# Altium schematic sheet SCH_NUCLEO.SchDoc
size A4
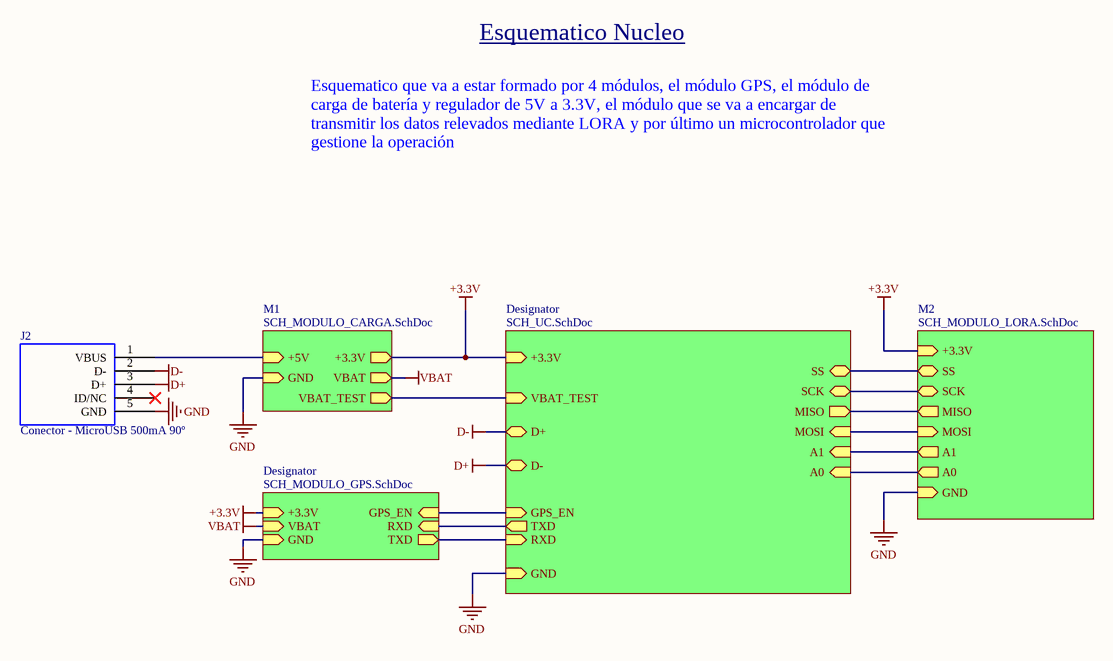
[diagram p0: SCH_NUCLEO.SchDoc]

## Parts
J2  Conector - MicroUSB 500mA 90º

## Sub-sheets
Designator = SCH_MODULO_GPS.SchDoc: +3.3V (in), VBAT (in), GND (in), GPS_EN (in), RXD (in), TXD (out)
Designator = SCH_UC.SchDoc: VBAT_TEST (in), D+ (bidir), MISO (out), A0 (in), GND (in), MOSI (in), +3.3V (in), GPS_EN (in), SCK (bidir), A1 (in), SS (bidir), D- (bidir), TXD (out), RXD (in)
M1 = SCH_MODULO_CARGA.SchDoc: +5V (in), GND (in), +3.3V (out), VBAT (out), VBAT_TEST (out)
M2 = SCH_MODULO_LORA.SchDoc: SCK (bidir), SS (bidir), GND (in), +3.3V (in), MISO (out), MOSI (in), A1 (out), A0 (out)

## Nets
+3.3V: sheet M1/+3.3V, sheet M2/+3.3V, sheet Designator/+3.3V, sheet Designator/+3.3V
D+: J2.3(D+) ; sheet Designator/D-
D-: J2.2(D-) ; sheet Designator/D+
GND: J2.5(GND) ; sheet M1/GND, sheet M2/GND, sheet Designator/GND, sheet Designator/GND
VBAT: sheet M1/VBAT, sheet Designator/VBAT
NetJ2_1: J2.1(VBUS) ; sheet M1/+5V
(unnamed): sheet M1/VBAT_TEST, sheet Designator/VBAT_TEST
(unnamed): sheet M2/SCK, sheet Designator/SCK
(unnamed): sheet M2/SS, sheet Designator/SS
(unnamed): sheet M2/MISO, sheet Designator/MISO
(unnamed): sheet M2/MOSI, sheet Designator/MOSI
(unnamed): sheet M2/A1, sheet Designator/A1
(unnamed): sheet M2/A0, sheet Designator/A0
(unnamed): sheet Designator/GPS_EN, sheet Designator/GPS_EN
(unnamed): sheet Designator/RXD, sheet Designator/TXD
(unnamed): sheet Designator/TXD, sheet Designator/RXD

Not connected (* = marked no-connect by the designer): J2 4(ID/NC)*

## Notes on the sheet
- Esquematico Nucleo
- Esquematico que va a estar formado por 4 módulos, el módulo GPS, el módulo de carga de batería y regulador de 5V a 3.3V, el módulo que se va a encargar de transmitir los datos relevados mediante LORA y por último un microcontrolador que gestione la operación
- 27/06/20
- Fecha
- Cambio Formulario
- Emision Inicial
- Versión
- 00
- Producto
- Código
- Cambio Circuito Eléctrico
- CI N°
- Nivel
- UBM:
- Revisó
- Cód. Formulario
- Realizó
- 1
- PF-ID-014-P
- Aprobó
- Vigencia
- COPIA NO CONTROLADA AL IMPRIMIR
- 15/05/2016
- A4
- Cargo
- 1/1

## Library data of the parts
J2 = Conector - MicroUSB 500mA 90º: Conector Micro USB